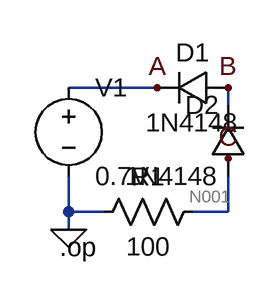
[diagram p0: schematic Draft1.asc]
Draft1.asc, the LTspice schematic file:
Version 4
SHEET 1 880 680
WIRE 192 128 112 128
WIRE 256 144 256 128
WIRE 112 240 112 208
WIRE 144 240 112 240
WIRE 256 240 256 208
WIRE 256 240 224 240
WIRE 112 256 112 240
FLAG 112 256 0
FLAG 192 128 A
FLAG 256 128 B
FLAG 256 192 C
DATAFLAG 192 128 "$-V(B)"
DATAFLAG 256 144 "$-V(N001)"
SYMBOL voltage 112 112 R0
WINDOW 123 0 0 Left 0
WINDOW 39 0 0 Left 0
SYMATTR InstName V1
SYMATTR Value 0.7V
SYMBOL diode 256 112 R90
WINDOW 0 0 32 VBottom 2
WINDOW 3 32 32 VTop 2
SYMATTR InstName D1
SYMATTR Value 1N4148
SYMBOL diode 272 208 R180
WINDOW 0 24 64 Left 2
WINDOW 3 24 0 Left 2
SYMATTR InstName D2
SYMATTR Value 1N4148
SYMBOL res 240 224 R90
WINDOW 0 0 56 VBottom 2
WINDOW 3 32 56 VTop 2
SYMATTR InstName R1
SYMATTR Value 100
TEXT 104 272 Left 2 !.op

The netlist it stands for:
* Draft1.asc
V1 A 0 0.7V
D1 B A 1N4148
D2 N001 B 1N4148
R1 N001 0 100
.model D D
.lib standard.dio
.op
.backanno
.end

* Results of the author's LTspice run, read from the files saved beside the schematic
* Operating Point:
*   V(a) = 700 mV
*   V(b) = 350 mV
*   V(n001) = 251.9 nV
*   I(D1) = -2.519 nA
*   I(D2) = -2.519 nA
*   I(R1) = 2.519 nA
*   I(V1) = -2.519 nA
* From the log:
*   Semiconductor Device Operating Points:
*                           --- Diodes ---
*   Name:      d1          d2
*   Model:   1n4148      1n4148
*   Id:     -2.52e-09   -2.52e-09
*   Vd:     -3.50e-01   -3.50e-01
*   Req:     3.91e+10    3.91e+10
*   CAP:     3.55e-12    3.55e-12